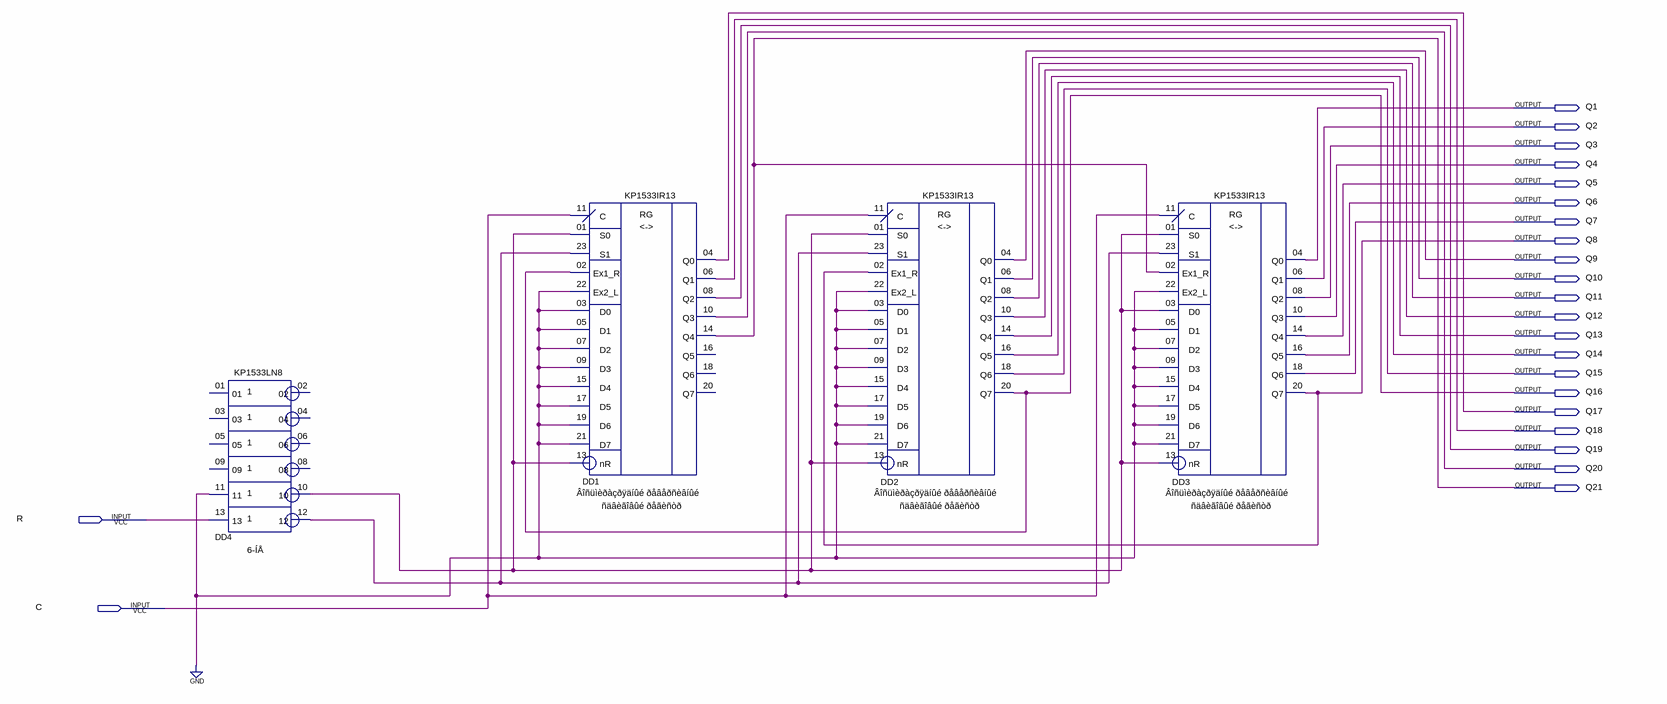
[diagram p0: schematic sheet]
// Quartus schematic ShiftRegRC.bdf as structural Verilog: 4 symbols, 23 pins
module ShiftRegRC (
  input  R,
  input  C,
  output Q1,
  output Q2,
  output Q3,
  output Q4,
  output Q5,
  output Q6,
  output Q7,
  output Q8,
  output Q9,
  output Q10,
  output Q11,
  output Q12,
  output Q13,
  output Q14,
  output Q15,
  output Q16,
  output Q17,
  output Q18,
  output Q19,
  output Q20,
  output Q21
);

  wire DD4_10, DD4_12;

  KP1533LN8 DD4 (.\11 (1'b0), .\13 (R), .\10 (DD4_10), .\12 (DD4_12));  // open: 01, 03, 05, 09, 02, 04, 06, 08
  KP1533IR13 DD1 (
    .Ex2_L(1'b0), .Ex1_R(Q16), .D0(1'b0), .D1(1'b0), .D2(1'b0), .D3(1'b0), .D4(1'b0), .D5(1'b0), .D6(1'b0),
    .D7(1'b0), .S0(DD4_10), .S1(DD4_12), .nR(DD4_10), .C(C), .Q0(Q17), .Q1(Q18), .Q2(Q19), .Q3(Q20), .Q4(Q21));  // open: Q5, Q6, Q7
  KP1533IR13 DD2 (
    .Ex2_L(1'b0), .Ex1_R(Q8), .D0(1'b0), .D1(1'b0), .D2(1'b0), .D3(1'b0), .D4(1'b0), .D5(1'b0), .D6(1'b0),
    .D7(1'b0), .S0(DD4_10), .S1(DD4_12), .nR(DD4_10), .C(C), .Q0(Q9), .Q1(Q10), .Q2(Q11), .Q3(Q12), .Q4(Q13),
    .Q5(Q14), .Q6(Q15), .Q7(Q16));
  KP1533IR13 DD3 (
    .Ex2_L(1'b0), .Ex1_R(Q21), .D0(DD4_10), .D1(1'b0), .D2(1'b0), .D3(1'b0), .D4(1'b0), .D5(1'b0), .D6(1'b0),
    .D7(1'b0), .S0(DD4_10), .S1(DD4_12), .nR(DD4_10), .C(C), .Q0(Q1), .Q1(Q2), .Q2(Q3), .Q3(Q4), .Q4(Q5),
    .Q5(Q6), .Q6(Q7), .Q7(Q8));
endmodule
